# Altium schematic sheet KEY.SchDoc: FMC-320U-A-01
size A4; =address1: Author: DHS; Approved By: ???; Checked By: ???; Address1fd: L3, 12a Rodborough Rd; SheetNumber: 1; SheetTotal: 5; thisVersion: 1; thisRelease: 0; thisRevision: 0
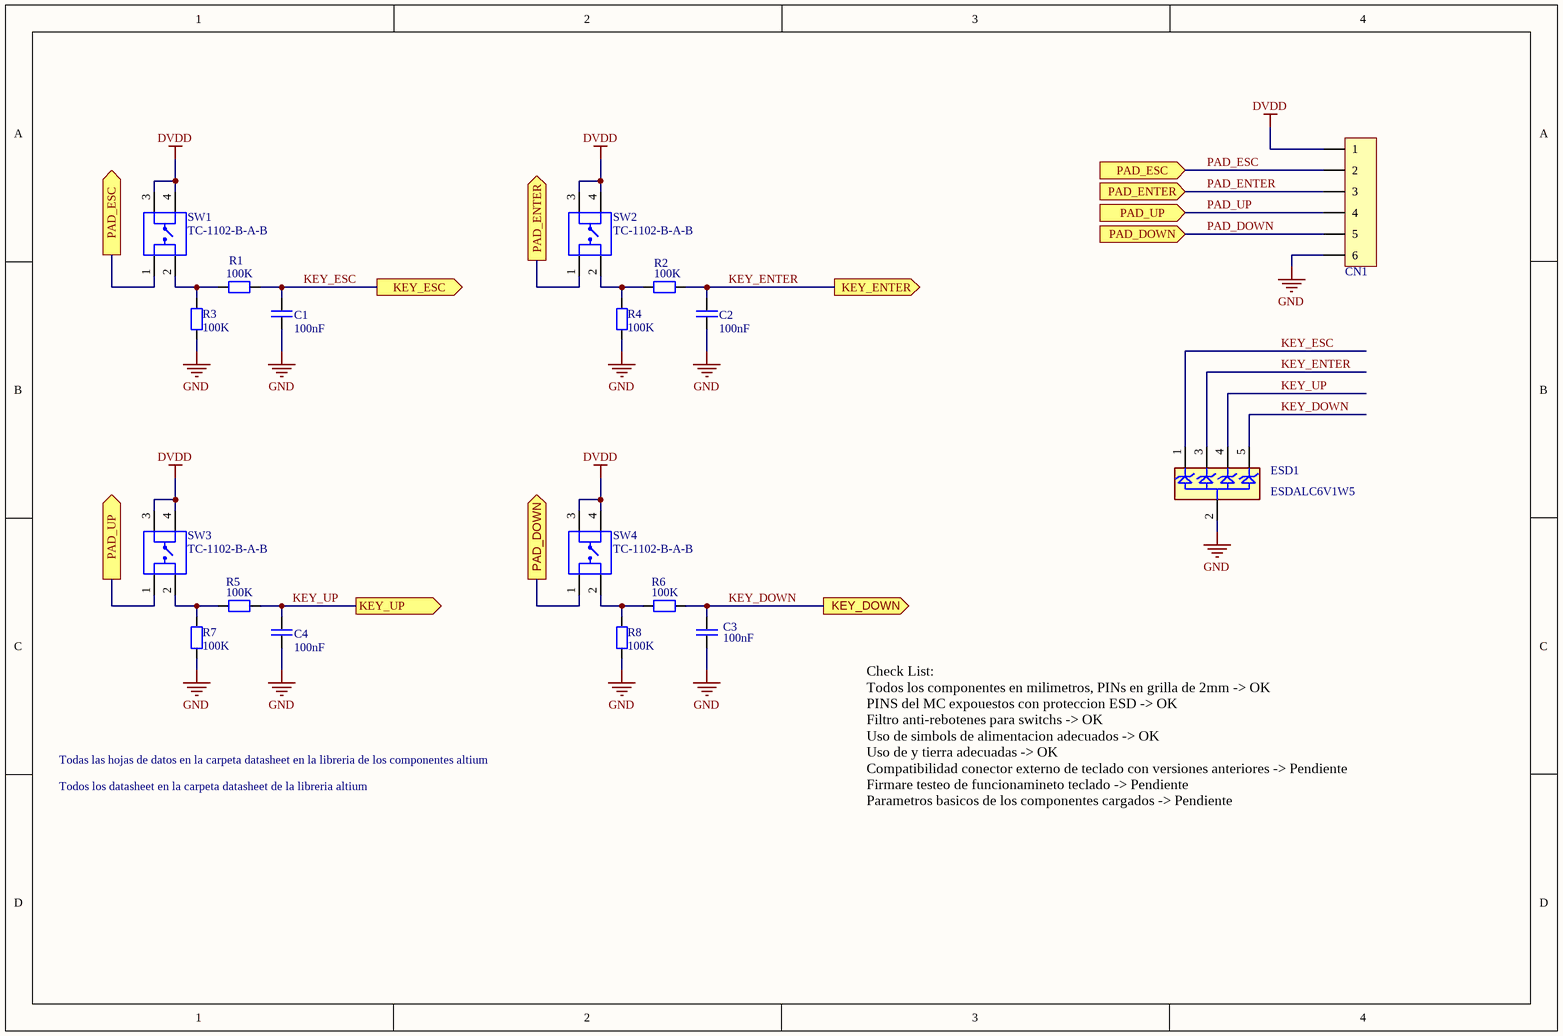
[diagram p0: KEY.SchDoc]

## Parts
C1  100nF  [CAP_SM0805_YAGEOCC2_N]
C2  100nF  [CAP_SM0805_YAGEOCC2_N]
C3  100nF  [CAP_SM0805_YAGEOCC2_N]
C4  100nF  [CAP_SM0805_YAGEOCC2_N]
CN1  PH2.54-07-06PWD  [HEADER PIN 1X6 A 90 GRADOS]  (value not drawn)
ESD1  ESDALC6V1W5  [ESDALC6V1W5]
R1  100K  [RES_SM0805_YAGEORC_N]
R2  100K  [RES_SM0805_YAGEORC_N]
R3  100K  [RES_SM0805_YAGEORC_N]
R4  100K  [RES_SM0805_YAGEORC_N]
R5  100K  [RES_SM0805_YAGEORC_N]
R6  100K  [RES_SM0805_YAGEORC_N]
R7  100K  [RES_SM0805_YAGEORC_N]
R8  100K  [RES_SM0805_YAGEORC_N]
SW1  TC-1102-B-A-B  [TC-1102-B-A-B]
SW2  TC-1102-B-A-B  [TC-1102-B-A-B]
SW3  TC-1102-B-A-B  [TC-1102-B-A-B]
SW4  TC-1102-B-A-B  [TC-1102-B-A-B]

## Ports
KEY_DOWN (out), KEY_ENTER (out), KEY_ESC (out), KEY_UP (out), PAD_DOWN (in), PAD_DOWN (out), PAD_ENTER (in), PAD_ENTER (out), PAD_ESC (in), PAD_ESC (out), PAD_UP (in), PAD_UP (out)

## Nets
DVDD: CN1.1 SW1.3(g) SW1.4 SW2.3(g) SW2.4 SW3.3(g) SW3.4 SW4.3(g) SW4.4
GND: C1.2 C2.2 C3.2 C4.2 CN1.6 ESD1.2(GND) R3.1 R4.1 R7.1 R8.1
KEY_DOWN: C3.1 ESD1.5(I/04) R6.2 ; port KEY_DOWN
KEY_ENTER: C2.1 ESD1.3(I/02) R2.2 ; port KEY_ENTER
KEY_ESC: C1.1 ESD1.1(I/01) R1.2 ; port KEY_ESC
KEY_UP: C4.1 ESD1.4(I/03) R5.2 ; port KEY_UP
PAD_DOWN: CN1.5 SW4.1 ; port PAD_DOWN
PAD_ENTER: CN1.3 SW2.1 ; port PAD_ENTER
PAD_ESC: CN1.2 SW1.1 ; port PAD_ESC
PAD_UP: CN1.4 SW3.1 ; port PAD_UP
NetR1_1: R1.1 R3.2 SW1.2
NetR2_1: R2.1 R4.2 SW2.2
NetR5_1: R5.1 R7.2 SW3.2
NetR6_1: R6.1 R8.2 SW4.2

## Notes on the sheet
- Todos los datasheet en la carpeta datasheet de la libreria altium
- Todas las hojas de datos en la carpeta datasheet en la libreria de los componentes altium
- Check List:
  Todos los componentes en milimetros, PINs en grilla de 2mm -> OK
  PINS del MC expouestos con proteccion ESD -> OK
  Filtro anti-rebotenes para switchs -> OK
  Uso de simbols de alimentacion adecuados -> OK
  Uso de y tierra adecuadas -> OK
  Compatibilidad conector externo de teclado con versiones anteriores -> Pendiente
  Firmare testeo de funcionamineto teclado -> Pendiente
  Parametros basicos de los componentes cargados -> Pendiente
- Title:
- Size: A4
- Date:
- Sheet:
- Time:
- Of:
- Version:
- Revision:
- Release:
- FLOWMEET SRL
- File

## Library data of the parts
C1-C4 = CC0805KRX7R8BB104: CAP 100nF SM0805 X7R 25V YAGEO CC2; Tolerance (%): 10; Voltage Rating (Volts): 25; Category: Capacitor; Manufacturer: Yageo; Manufacturer Part Number: CC0805KRX7R8BB104; Package: 0805; Value: 100nF; Supplier Part Number 1: 644249; Supplier 1: Farnell; ComponentLink1URL: http://www.yageo.com; ComponentLink1Description: Manufacturer Website; Supplier 2: Digi-Key; Supplier Part Number 2: 311-1141-1-ND; Datasheet: https://datasheet.lcsc.com/lcsc/2006111832_YAGEO-CC0805KRX7R8BB104_C519981.pdf
CN1 = PH2.54-07-06PWD: 1 x 6 - true hole  2.54mm - Pb free - 90°; Manufacturer: XUNPU; Manufacturer Part Number: PH2.54-07-06PWD; Category: Header pin; Datasheet: https://datasheet.lcsc.com/lcsc/2202082130_Amphenol-ICC-54101-T06-00_C213463.pdf; Temperature Max: 125; Temperature Min: -65
ESD1 = ESDALC6V1W5: TVS Diode Array Uni-Directional 6.1V / QTY 5 per pack, SOT-323 / Ranking 5: / Marca reconocida. / Usado en placas nucleo, sometidas a manipuleo nunca note un pin quemado por ESD.; Manufacturer: ST; Manufacturer Part Number: ESDALC6V1W5; Category: Diodo; Datasheet: https://www.st.com/content/ccc/resource/technical/document/datasheet/32/30/02/e6/ac/0f/46/c2/CD00002946.pdf/files/CD00002946.pdf/jcr:content/translations/en.CD00002946.pdf; Temperature Max: 150; Temperature Min: -40
R1-R8 = RC0805FR-07100KL: RES 100K SM0805 YAGEO RC_L; Power (Watts): 0.125; Resistance (Ohms): 100000; Tolerance (%): 1; Category: Resistor; Manufacturer: Yageo; Manufacturer Part Number: RC0805FR-07100KL; Package: 0805; Value: 100K; Supplier Part Number 1: 9237879; Supplier 1: Farnell; ComponentLink1Description: Manufacturer Website; ComponentLink1URL: http://www.yageo.com; Supplier 2: Digi-Key; Supplier Part Number 2: 311-100KCRCT-ND; Datasheet: https://www.yageo.com/upload/media/product/app/datasheet/rchip/pyu-rc_group_51_rohs_l.pdf
SW1-SW4 = TC-1102-B-A-B: Switch tactile 6x6mm true hole.; Manufacturer: XKB Connectivity; Category: Mechanical Switch; Manufacturer Part Number: TC-1102-B-A-B; Datasheet: https://datasheet.lcsc.com/lcsc/2110111230_XKB-Connectivity-TC-1102-B-A-B_C480281.pdf; Temperature Max: 85; Temperature Min: -30
  SW1: Main supplier: LCSC